# EAGLE schematic Circuito (EAGLE 7.2.0)
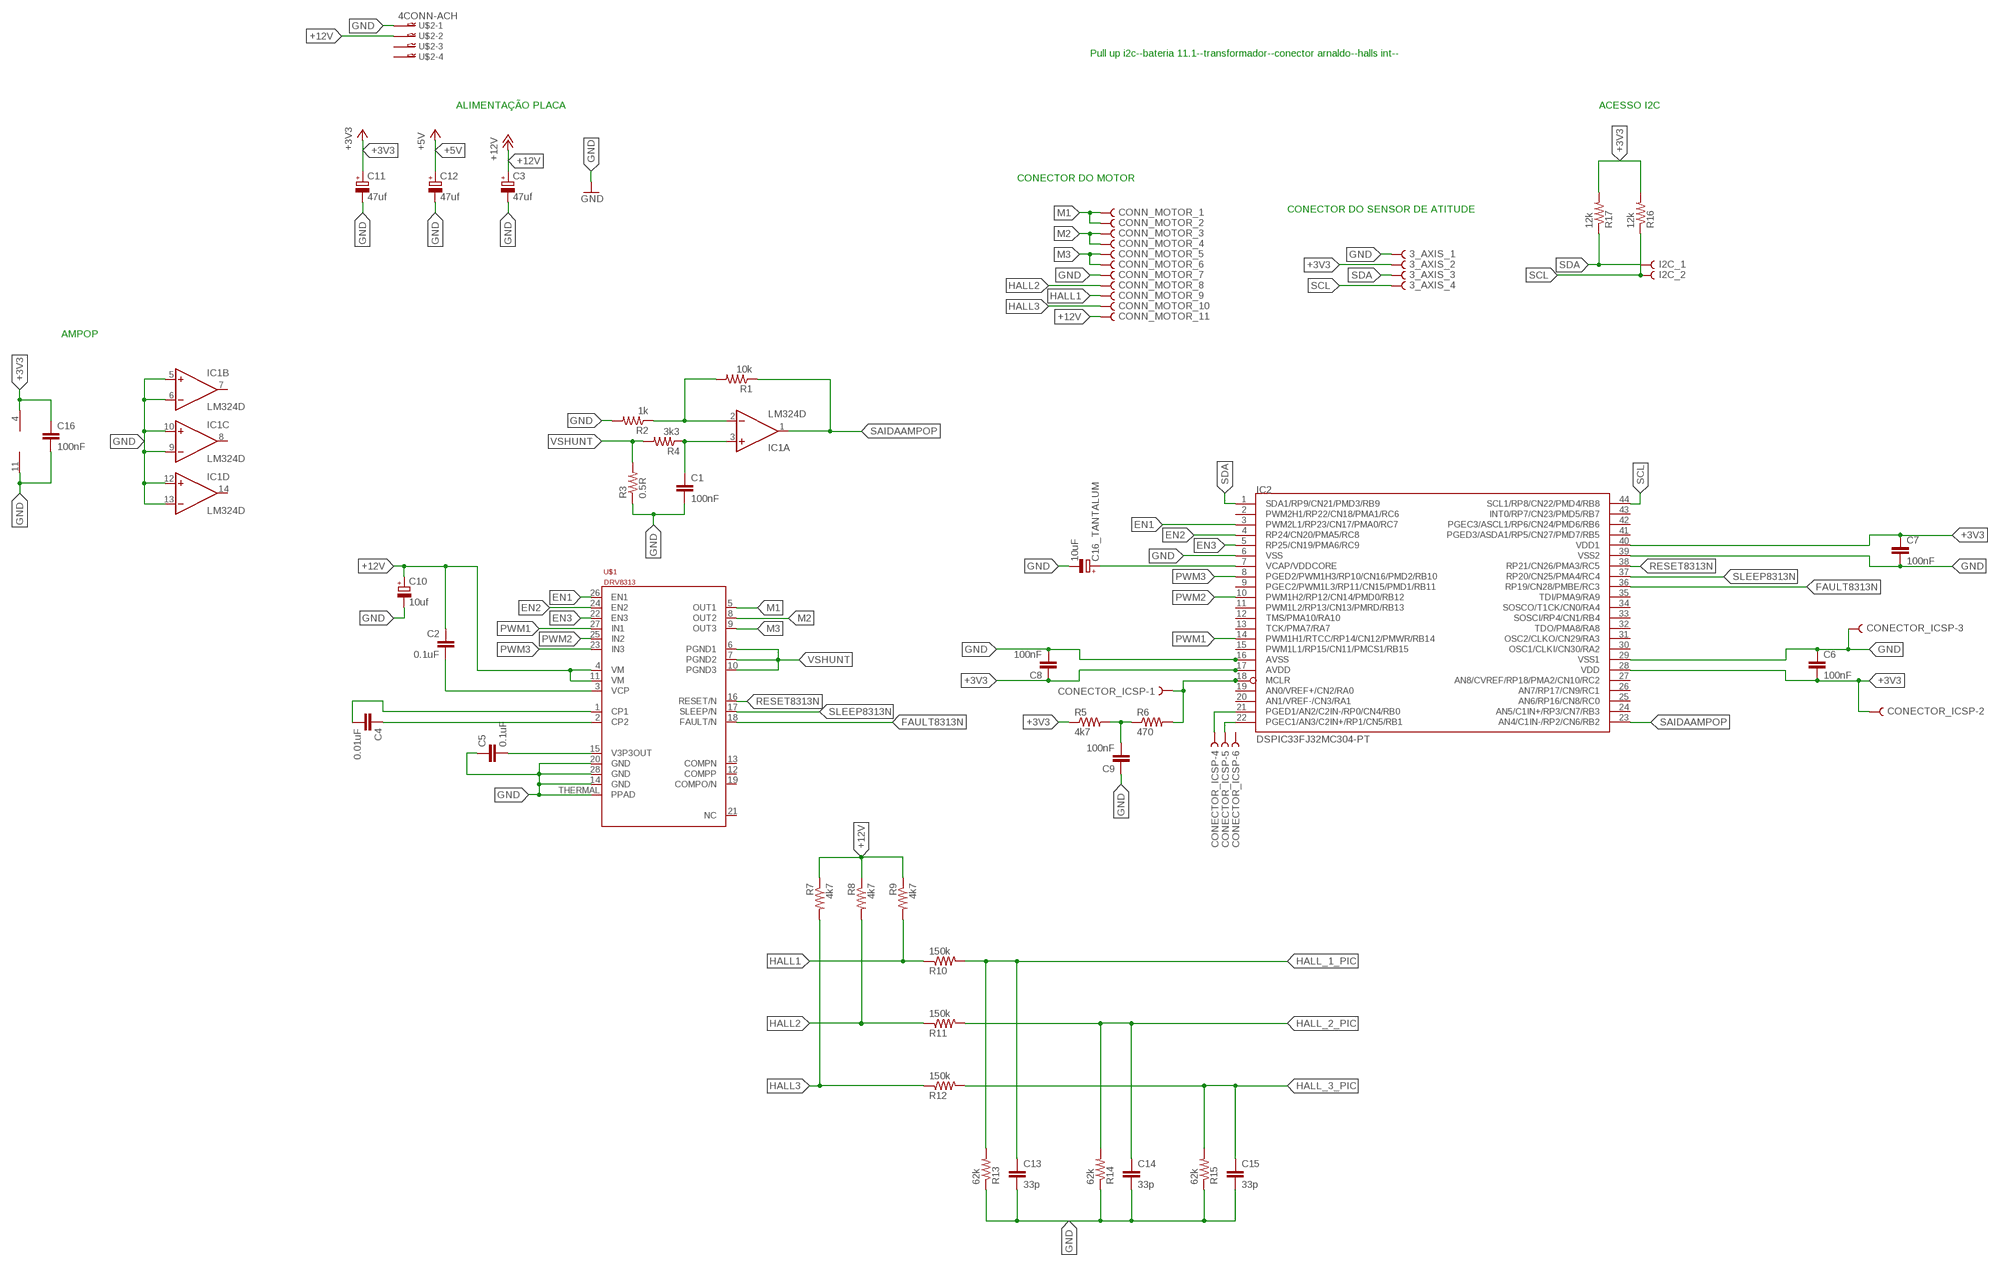
[diagram p0: schematic, sheet 1]

## Parts
3_AXIS_  1_ROW-4_PINS-2.54MM  [1_ROW-4_PINS]
C1  100nF  C-EUC1206  [C1206]
C2  0.1uF  C-EUC0805  [C0805]
C3  47uf  CPOL-EU153CLV-0505  [153CLV-0505]
C4  0.01uF  C-EUC0805  [C0805]
C5  0.1uF  C-EUC0805  [C0805]
C6  100nF  C-EUC0805  [C0805]
C7  100nF  C-EUC0805  [C0805]
C8  100nF  C-EUC0805  [C0805]
C9  100nF  C-EUC0805  [C0805]
C10  10uf  CPOL-EU153CLV-0505  [153CLV-0505]
C11  47uf  CPOL-EU153CLV-0505  [153CLV-0505]
C12  47uf  CPOL-EU153CLV-0505  [153CLV-0505]
C13  33p  C-EUC0603  [C0603]
C14  33p  C-EUC0603  [C0603]
C15  33p  C-EUC0603  [C0603]
C16  100nF  C-EUC1206  [C1206]
C16_TANTALUM  10uF  CPOL-EUSMCC  [SMC_C]
CONECTOR_ICSP-  1_ROW-6_PINS-2.54MM  [1_ROW-6_PINS]
CONN_MOTOR_  1-84953-1  [1-84953-1]
I2C_  1_ROW-2_PINS-2.54MM  [1_ROW-2_PINS]
IC1  LM324D  [SO14]
IC2  DSPIC33FJ32MC304-PT  [TQFP44]
R1  10k  R-US_M1206  [M1206]
R2  1k  R-US_M1206  [M1206]
R3  0.5R  R-US_M1206  [M1206]
R4  3k3  R-US_M1206  [M1206]
R5  4k7  R-US_M1206  [M1206]
R6  470  R-US_M1206  [M1206]
R7  4k7  R-US_M0805  [M0805]
R8  4k7  R-US_M0805  [M0805]
R9  4k7  R-US_M0805  [M0805]
R10  150k  R-US_M0805  [M0805]
R11  150k  R-US_M0805  [M0805]
R12  150k  R-US_M0805  [M0805]
R13  62k  R-US_M0805  [M0805]
R14  62k  R-US_M0805  [M0805]
R15  62k  R-US_M0805  [M0805]
R16  12k  R-US_M0805  [M0805]
R17  12k  R-US_M0805  [M0805]
U$1  DRV8811PWP/R  [HTSSOP28]
U$2  4CONN-ACH  [4CONN-ACH]

## Nets
+3V3: 3_AXIS_.2 C6.2 C7.1 C8.1 C11.+ C16.1 CONECTOR_ICSP-.1 CONECTOR_ICSP-.2 IC1.4(P:V+) IC2.17(AVDD) IC2.18(MCLR) IC2.28(VDD) IC2.40(VDD1) R5.1 R6.2 R16.2 R17.2
+5V: C12.+
+12V: C2.1 C3.+ C10.+ CONN_MOTOR_.11 R7.1 R8.1 R9.1 U$1.4(VM) U$1.11(VM) U$2.2
CP1: C4.2 U$1.1(CP1)
EN1: IC2.3(PWM2L1/RP23/CN17/PMA0/RC7) U$1.26(EN1)
EN2: IC2.4(RP24/CN20/PMA5/RC8) U$1.24(EN2)
EN3: IC2.5(RP25/CN19/PMA6/RC9) U$1.22(EN3)
FAULT8313N: IC2.36(RP19/CN28/PMBE/RC3) U$1.18(FAULT/N)
GND: 3_AXIS_.1 C1.2 C3.- C5.1 C6.1 C7.2 C8.2 C9.1 C10.- C11.- C12.- C13.2 C14.2 C15.2 C16.2 C16_TANTALUM.- CONECTOR_ICSP-.3 CONN_MOTOR_.7 IC1.5(B:+IN) IC1.6(B:-IN) IC1.9(C:-IN) IC1.10(C:+IN) IC1.11(P:V-) IC1.12(D:+IN) IC1.13(D:-IN) IC2.6(VSS) IC2.16(AVSS) IC2.29(VSS1) IC2.39(VSS2) R2.2 R3.1 R13.1 R14.1 R15.1 U$1.14(GND) U$1.20(GND) U$1.28(GND) U$1.THERMAL(PPAD) U$2.1
HALL1: CONN_MOTOR_.9 R9.2 R10.1
HALL2: CONN_MOTOR_.8 R8.2 R11.1
HALL3: CONN_MOTOR_.10 R7.2 R12.1
HALL_1_PIC: C13.1 R10.2 R13.2
HALL_2_PIC: C14.1 R11.2 R14.2
HALL_3_PIC: C15.1 R12.2 R15.2
M1: CONN_MOTOR_.1 CONN_MOTOR_.2 U$1.5(OUT1)
M2: CONN_MOTOR_.3 CONN_MOTOR_.4 U$1.8(OUT2)
M3: CONN_MOTOR_.5 CONN_MOTOR_.6 U$1.9(OUT3)
N$1: IC1.2(A:-IN) R1.2 R2.1
N$5: C4.1 U$1.2(CP2)
N$6: C2.2 U$1.3(VCP)
N$8: C9.2 R5.2 R6.1
N$11: CONECTOR_ICSP-.4 IC2.21(PGED1/AN2/C2IN-/RP0/CN4/RB0)
N$12: CONECTOR_ICSP-.5 IC2.22(PGEC1/AN3/C2IN+/RP1/CN5/RB1)
PWM1: IC2.14(PWM1H1/RTCC/RP14/CN12/PMWR/RB14) U$1.27(IN1)
PWM2: IC2.10(PWM1H2/RP12/CN14/PMD0/RB12) U$1.25(IN2)
PWM3: IC2.8(PGED2/PWM1H3/RP10/CN16/PMD2/RB10) U$1.23(IN3)
RESET8313N: IC2.38(RP21/CN26/PMA3/RC5) U$1.16(RESET/N)
SAIDAAMPOP: IC1.1(A:OUT) IC2.23(AN4/C1IN-/RP2/CN6/RB2) R1.1
SCL: 3_AXIS_.4 I2C_.2 IC2.44(SCL1/RP8/CN22/PMD4/RB8) R16.1
SDA: 3_AXIS_.3 I2C_.1 IC2.1(SDA1/RP9/CN21/PMD3/RB9) R17.1
SLEEP8313N: IC2.37(RP20/CN25/PMA4/RC4) U$1.17(SLEEP/N)
V3P3OUT: C5.2 U$1.15(V3P3OUT)
VCAP/VDDCORE: C16_TANTALUM.+ IC2.7(VCAP/VDDCORE)
VSHUNT: C1.1 IC1.3(A:+IN) R3.2 R4.1 R4.2 U$1.6(PGND1) U$1.7(PGND2) U$1.10(PGND3)
Unconnected: CONECTOR_ICSP-.6 IC1.7(B:OUT) IC1.8(C:OUT) IC1.14(D:OUT) IC2.2(PWM2H1/RP22/CN18/PMA1/RC6) IC2.9(PGEC2/PWM1L3/RP11/CN15/PMD1/RB11) IC2.11(PWM1L2/RP13/CN13/PMRD/RB13) IC2.12(TMS/PMA10/RA10) IC2.13(TCK/PMA7/RA7) IC2.15(PWM1L1/RP15/CN11/PMCS1/RB15) IC2.19(AN0/VREF+/CN2/RA0) IC2.20(AN1/VREF-/CN3/RA1) IC2.24(AN5/C1IN+/RP3/CN7/RB3) IC2.25(AN6/RP16/CN8/RC0) IC2.26(AN7/RP17/CN9/RC1) IC2.27(AN8/CVREF/RP18/PMA2/CN10/RC2) IC2.30(OSC1/CLKI/CN30/RA2) IC2.31(OSC2/CLKO/CN29/RA3) IC2.32(TDO/PMA8/RA8) IC2.33(SOSCI/RP4/CN1/RB4) IC2.34(SOSCO/T1CK/CN0/RA4) IC2.35(TDI/PMA9/RA9) IC2.41(PGED3/ASDA1/RP5/CN27/PMD7/RB5) IC2.42(PGEC3/ASCL1/RP6/CN24/PMD6/RB6) IC2.43(INT0/RP7/CN23/PMD5/RB7) U$1.12(COMPP) U$1.13(COMPN) U$1.19(COMPO/N) U$2.3 U$2.4

## Notes on the sheet
- Pull up i2c--bateria 11.1--transformador--conector arnaldo--halls int--
- ALIMENTAÇÃO PLACA | ACESSO I2C
- CONECTOR DO MOTOR
- CONECTOR DO SENSOR DE ATITUDE
- AMPOP

## Power pins joined to a net without a drawn wire
NC: U$1.21(NC)

## Library data of the parts
3_AXIS_ = con-leotronics:1_ROW-4_PINS-2.54MM
C1 C16 = resistor:C-EU: CAPACITOR, European symbol
C2 C4-C9 C13-C15 = rcl:C-EU: CAPACITOR, European symbol
C3 C10-C12 C16_TANTALUM = rcl:CPOL-EU: POLARIZED CAPACITOR, European symbol
CONECTOR_ICSP- = con-leotronics:1_ROW-6_PINS-2.54MM
CONN_MOTOR_ = Tyco Connector:1-84953-1
I2C_ = con-leotronics:1_ROW-2_PINS-2.54MM
IC1 = linear:LM324: OP AMP
IC2 = microchip-dspic33fjxxmc:DSPIC33FJ32MC304: dsPIC33FJ32MC302/304, dsPIC33FJ64MCX02/X04, AND dsPIC33FJ128MCX02/X04 High-Performance, 16-bit Digital Signal Controllers Operating Range: * Up to 40 MIPS operation (at 3.0V -3.6V): - Industrial temperature range (-40°C to +85°C) - Extended temperature range (-40°C to +125°C) High-Performance DSC CPU: * Modified Harvard architecture * C compiler optimized instruction set * 16-bit wide data path * 24-bit wide instructions * Linear program memory addressing up to 4M instruction words * Linear data memory addressing up to 64 Kbytes * 83 base instructions: mostly 1 word/1 cycle * Two 40-bit accumulators with rounding and saturation options * Flexible and powerful addressing modes: - Indirect - Modulo - Bit-Reversed * Software stack * 16 x 16 fractional/integer multiply operations * 32/16 and 16/16 divide operations * Single-cycle multiply and accumulate: - Accumulator write back for DSP operations - Dual data fetch * Up to ±16-bit shifts for up to 40-bit data Direct Memory Access (DMA): * 8-channel hardware DMA * Up to 2 Kbytes dual ported DMA buffer area (DMA RAM) to store data transferred via DMA: - Allows data transfer between RAM and a peripheral while CPU is executing code (no cycle stealing) * Most peripherals support DMA Timers/Capture/Compare/PWM: * Timer/Counters, up to five 16-bit timers: - Can pair up to make two 32-bit timers - One timer runs as a Real-Time Clock with an external 32.768 kHz oscillator - Programmable prescaler * Input Capture (up to four channels): - Capture on up, down or both edges - 16-bit capture input functions - 4-deep FIFO on each capture * Output Compare (up to four channels): - Single or Dual 16-bit Compare mode - 16-bit Glitchless PWM mode * Hardware Real-Time Clock/Calendar (RTCC): - Provides clock, calendar, and alarm functions Interrupt Controller: * 5-cycle latency * Up to 53 available interrupt sources * Up to three external interrupts * Seven programmable priority levels * Five processor exceptions Digital I/O: * Peripheral pin Select functionality * Up to 35 programmable digital I/O pins * Wake-up/Interrupt-on-Change for up to 31 pins * Output pins can drive from 3.0V to 3.6V * Up to 5V output with open drain configuration * All digital input pins are 5V tolerant * 4 mA sink on all I/O pins On-Chip Flash and SRAM: * Flash program memory (up to 128 Kbytes) * Data SRAM (up to 16 Kbytes) * Boot, Secure, and General Security for program Flash System Management: * Flexible clock options: - External, crystal, resonator, internal RC - Fully integrated Phase-Locked Loop (PLL) - Extremely low jitter PLL * Power-up Timer * Oscillator Start-up Timer/Stabilizer * Watchdog Timer with its own RC oscillator * Fail-Safe Clock Monitor * Reset by multiple sources Power Management: * On-chip 2.5V voltage regulator * Switch between clock sources in real time * Idle, Sleep, and Doze modes with fast wake-up Analog-to-Digital Converters (ADCs): * 10-bit, 1.1 Msps or 12-bit, 500 Ksps conversion: - Two and four simultaneous samples (10-bit ADC) - Up to nine input channels with auto-scanning - Conversion start can be manual or synchronized with one of four trigger sources - Conversion possible in Sleep mode - ±2 LSb max integral nonlinearity - ±1 LSb max differential nonlinearity Audio Digital-to-Analog Converter (DAC): - 16-bit Dual Channel DAC module - 100 Ksps maximum sampling rate - Second-Order Digital Delta-Sigma Modulator Comparator Module: * Two analog comparators with programmable input/output configuration CMOS Flash Technology: * Low-power, high-speed Flash technology * Fully static design * 3.3V (±10%) operating voltage * Industrial and Extended temperature * Low power consumption Motor Control Peripherals: * 6-channel 16-bit Motor Control PWM: - Three duty cycle generators - Independent or Complementary mode - Programmable dead-time and output polarity - Edge-aligned or center-aligned - Manual output override control - One Fault input - Trigger for ADC conversions - PWM frequency for 16-bit resolution (@ 40 MIPS) = 1220 Hz for Edge-Aligned mode, 610 Hz for Center-Aligned mode - PWM frequency for 11-bit resolution (@ 40 MIPS) = 39.1 kHz for Edge-Aligned mode, 19.55 kHz for Center-Aligned mode * 2-channel 16-bit Motor Control PWM: - One duty cycle generator - Independent or Complementary mode - Programmable dead time and output polarity - Edge-aligned or center-aligned - Manual output override control - One Fault input - Trigger for ADC conversions - PWM frequency for 16-bit resolution (@ 40 MIPS) = 1220 Hz for Edge-Aligned mode, 610 Hz for Center-Aligned mode - PWM frequency for 11-bit resolution (@ 40 MIPS) = 39.1 kHz for Edge-Aligned mode, 19.55 kHz for Center-Aligned mode * 2-Quadrature Encoder Interface module: - Phase A, Phase B, and index pulse input - 16-bit up/down position counter - Count direction status - Position Measurement (x2 and x4) mode - Programmable digital noise filters on inputs - Alternate 16-bit Timer/Counter mode - Interrupt on position counter rollover/underflow
R1-R6 = resistor:R-US_: RESISTOR, American symbol
R7-R17 = rcl:R-US_: RESISTOR, American symbol
U$1 = texas-drv8313:DRV8811: Stepper Motor Controller The DRV8811 IC provides an integrated stepper motor driver solution. The device has two H-bridge drivers, as well as microstepping indexer logic to control a stepper motor. The output driver block for each consists of N-channel power MOSFETs configured as full H-bridges to drive the motor windings. Source: http://www.ti.com/lit/ds/symlink/drv8811.pdf; MF: TEXAS INSTRUMENTS
U$2 = con-jst:4CONN-ACH